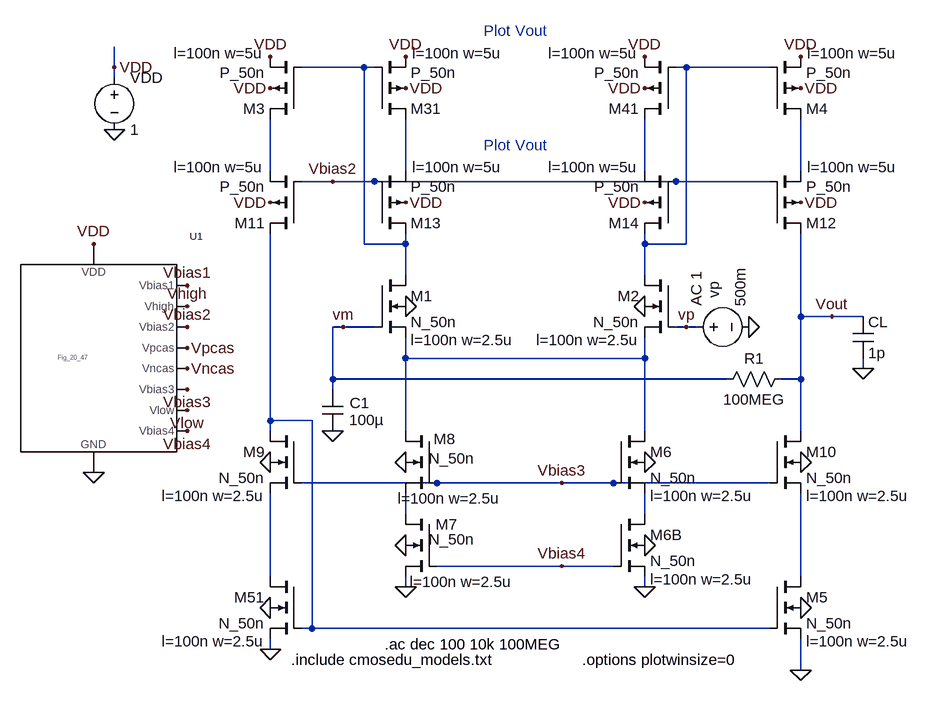
[diagram p0: schematic Fig24_36.asc]
Fig24_36.asc, the LTspice schematic file:
Version 4
SHEET 1 2652 680
WIRE 1136 -960 1136 -992
WIRE 1520 -960 1424 -960
WIRE 1536 -960 1520 -960
WIRE 2016 -960 2000 -960
WIRE 2144 -960 2016 -960
WIRE 1136 -944 1136 -960
WIRE 1376 -800 1376 -880
WIRE 1584 -800 1584 -880
WIRE 1952 -800 1952 -880
WIRE 2192 -800 2192 -880
WIRE 1472 -784 1424 -784
WIRE 1536 -784 1472 -784
WIRE 2000 -784 1536 -784
WIRE 2144 -784 2000 -784
WIRE 1520 -688 1520 -960
WIRE 1584 -688 1584 -704
WIRE 1584 -688 1520 -688
WIRE 1952 -688 1952 -704
WIRE 2016 -688 2016 -960
WIRE 2016 -688 1952 -688
WIRE 1584 -640 1584 -688
WIRE 1952 -640 1952 -688
WIRE 2192 -576 2192 -704
WIRE 2240 -576 2192 -576
WIRE 2288 -576 2240 -576
WIRE 1488 -560 1472 -560
WIRE 1536 -560 1488 -560
WIRE 2016 -560 2000 -560
WIRE 2032 -560 2016 -560
WIRE 1584 -512 1584 -544
WIRE 1952 -512 1952 -544
WIRE 1952 -512 1584 -512
WIRE 2288 -496 2288 -512
WIRE 1472 -480 1472 -560
WIRE 2080 -480 1472 -480
WIRE 2192 -480 2192 -576
WIRE 2192 -480 2160 -480
WIRE 1472 -464 1472 -480
WIRE 1376 -416 1376 -704
WIRE 1440 -416 1376 -416
WIRE 1376 -400 1376 -416
WIRE 1584 -400 1584 -512
WIRE 1952 -400 1952 -512
WIRE 2192 -400 2192 -480
WIRE 1632 -320 1424 -320
WIRE 1824 -320 1632 -320
WIRE 1904 -320 1824 -320
WIRE 2144 -320 1904 -320
WIRE 1584 -272 1584 -304
WIRE 1952 -272 1952 -304
WIRE 1824 -192 1632 -192
WIRE 1904 -192 1824 -192
WIRE 1376 -176 1376 -304
WIRE 2192 -176 2192 -304
WIRE 1584 -160 1584 -176
WIRE 1952 -160 1952 -176
WIRE 1440 -96 1440 -416
WIRE 1440 -96 1424 -96
WIRE 2144 -96 1440 -96
WIRE 1376 -64 1376 -80
WIRE 2192 -32 2192 -80
FLAG 1136 -864 0
FLAG 1136 -960 VDD
FLAG 1952 -592 0
FLAG 1952 -160 0
FLAG 1584 -592 0
FLAG 1376 -928 VDD
FLAG 1104 -688 VDD
FLAG 1104 -336 0
FLAG 1248 -624 Vbias1
FLAG 1248 -592 Vhigh
FLAG 1248 -560 Vbias2
FLAG 1248 -464 Vbias3
FLAG 1248 -528 Vpcas
FLAG 1248 -496 Vncas
FLAG 1248 -400 Vbias4
FLAG 1248 -432 Vlow
FLAG 1376 -976 VDD
FLAG 1952 -224 0
FLAG 2112 -560 0
FLAG 1488 -560 vm
FLAG 2016 -560 vp
FLAG 1376 -64 0
FLAG 2192 -928 VDD
FLAG 2192 -32 0
FLAG 2192 -976 VDD
FLAG 2240 -576 Vout
FLAG 1472 -400 0
FLAG 2288 -496 0
FLAG 1584 -928 VDD
FLAG 1584 -976 VDD
FLAG 1952 -976 VDD
FLAG 1952 -928 VDD
FLAG 1952 -352 0
FLAG 1584 -160 0
FLAG 1584 -224 0
FLAG 1584 -352 0
FLAG 1824 -320 Vbias3
FLAG 1824 -192 Vbias4
FLAG 1376 -352 0
FLAG 1376 -128 0
FLAG 2192 -128 0
FLAG 2192 -352 0
FLAG 1376 -752 VDD
FLAG 2192 -752 VDD
FLAG 1584 -752 VDD
FLAG 1952 -752 VDD
FLAG 1472 -784 Vbias2
SYMBOL voltage 1136 -960 R0
WINDOW 123 0 0 Left 2
WINDOW 39 0 0 Left 2
SYMATTR InstName VDD
SYMATTR Value 1
SYMBOL nmos4 2000 -640 M0
WINDOW 123 56 100 Left 2
SYMATTR Value2 l=100n w=2.5u
SYMATTR InstName M2
SYMATTR Value N_50n
SYMBOL nmos4 1536 -640 R0
WINDOW 123 56 100 Left 2
SYMATTR Value2 l=100n w=2.5u
SYMATTR InstName M1
SYMATTR Value N_50n
SYMBOL pmos4 1424 -880 R180
WINDOW 123 58 102 Left 2
WINDOW 0 56 16 Left 2
SYMATTR Value2 l=100n w=5u
SYMATTR InstName M3
SYMATTR Value P_50n
SYMBOL Fig_20_47 1104 -512 R0
SYMATTR InstName U1
SYMBOL nmos4 1904 -272 R0
WINDOW 123 56 100 Left 2
SYMATTR Value2 l=100n w=2.5u
SYMATTR InstName M6B
SYMATTR Value N_50n
SYMBOL voltage 2016 -560 R270
WINDOW 0 45 42 Left 2
WINDOW 3 31 83 Left 2
WINDOW 39 0 0 Left 2
WINDOW 123 32 15 Left 2
SYMATTR InstName vp
SYMATTR Value 500m
SYMATTR Value2 AC 1
SYMBOL nmos4 1424 -176 M0
WINDOW 123 56 100 Left 2
SYMATTR Value2 l=100n w=2.5u
SYMATTR InstName M51
SYMATTR Value N_50n
SYMBOL pmos4 2144 -880 M180
WINDOW 123 58 102 Left 2
WINDOW 0 56 16 Left 2
SYMATTR Value2 l=100n w=5u
SYMATTR InstName M4
SYMATTR Value P_50n
SYMBOL nmos4 2144 -176 R0
WINDOW 123 56 100 Left 2
SYMATTR Value2 l=100n w=2.5u
SYMATTR InstName M5
SYMATTR Value N_50n
SYMBOL res 2064 -464 R270
WINDOW 0 32 56 VTop 2
WINDOW 3 0 56 VBottom 2
SYMATTR InstName R1
SYMATTR Value 100MEG
SYMBOL cap 2272 -576 R0
SYMATTR InstName CL
SYMATTR Value 1p
SYMBOL pmos4 1536 -880 M180
WINDOW 123 58 102 Left 2
WINDOW 0 56 16 Left 2
SYMATTR Value2 l=100n w=5u
SYMATTR InstName M31
SYMATTR Value P_50n
SYMBOL pmos4 2000 -880 R180
WINDOW 123 58 102 Left 2
WINDOW 0 56 16 Left 2
SYMATTR Value2 l=100n w=5u
SYMATTR InstName M41
SYMATTR Value P_50n
SYMBOL cap 1456 -464 R0
WINDOW 0 42 21 Left 2
WINDOW 3 41 47 Left 2
SYMATTR InstName C1
SYMATTR Value 100µ
SYMBOL nmos4 1904 -400 R0
WINDOW 123 56 100 Left 2
SYMATTR Value2 l=100n w=2.5u
SYMATTR InstName M6
SYMATTR Value N_50n
SYMBOL nmos4 1632 -272 M0
WINDOW 123 -117 104 Left 2
WINDOW 0 -32 16 Left 2
WINDOW 3 -59 39 Left 2
SYMATTR Value2 l=100n w=2.5u
SYMATTR InstName M7
SYMATTR Value N_50n
SYMBOL nmos4 1632 -400 M0
WINDOW 123 -99 104 Left 2
WINDOW 0 -29 12 Left 2
WINDOW 3 -59 42 Left 2
SYMATTR Value2 l=100n w=2.5u
SYMATTR InstName M8
SYMATTR Value N_50n
SYMBOL nmos4 1424 -400 M0
WINDOW 123 56 100 Left 2
SYMATTR Value2 l=100n w=2.5u
SYMATTR InstName M9
SYMATTR Value N_50n
SYMBOL nmos4 2144 -400 R0
WINDOW 123 56 100 Left 2
SYMATTR Value2 l=100n w=2.5u
SYMATTR InstName M10
SYMATTR Value N_50n
SYMBOL pmos4 1424 -704 R180
WINDOW 123 58 102 Left 2
WINDOW 0 56 16 Left 2
SYMATTR Value2 l=100n w=5u
SYMATTR InstName M11
SYMATTR Value P_50n
SYMBOL pmos4 2144 -704 M180
WINDOW 123 58 102 Left 2
WINDOW 0 56 16 Left 2
SYMATTR Value2 l=100n w=5u
SYMATTR InstName M12
SYMATTR Value P_50n
SYMBOL pmos4 1536 -704 M180
WINDOW 123 58 102 Left 2
WINDOW 0 56 16 Left 2
SYMATTR Value2 l=100n w=5u
SYMATTR InstName M13
SYMATTR Value P_50n
SYMBOL pmos4 2000 -704 R180
WINDOW 123 58 102 Left 2
WINDOW 0 56 16 Left 2
SYMATTR Value2 l=100n w=5u
SYMATTR InstName M14
SYMATTR Value P_50n
TEXT 1408 -48 Left 2 !.include cmosedu_models.txt
TEXT 1704 -1016 Left 2 ;Plot Vout
TEXT 1552 -72 Left 2 !.ac dec 100 10k 100MEG
TEXT 1704 -840 Left 2 ;Plot Vout
TEXT 1856 -48 Left 2 !.options plotwinsize=0

The netlist it stands for:
* Fig24_36.asc
VDD VDD 0 1
M2 N002 vp N007 0 N_50n l=100n w=2.5u
M1 N001 vm N007 0 N_50n l=100n w=2.5u
M3 N003 N001 VDD VDD P_50n l=100n w=5u
XU1 Vbias1 Vhigh Vbias2 Vpcas Vncas Vbias3 Vlow Vbias4 VDD 0 Fig_20_47  ; pins Vbias1 Vhigh Vbias2 Vpcas Vncas Vbias3 Vlow Vbias4 VDD GND
M6B N010 Vbias4 0 0 N_50n l=100n w=2.5u
vp vp 0 500m AC 1
M51 N011 N008 0 0 N_50n l=100n w=2.5u
M4 N006 N002 VDD VDD P_50n l=100n w=5u
M5 N012 N008 0 0 N_50n l=100n w=2.5u
R1 vm Vout 100MEG
CL Vout 0 1p
M31 N004 N001 VDD VDD P_50n l=100n w=5u
M41 N005 N002 VDD VDD P_50n l=100n w=5u
C1 vm 0 100µ
M6 N007 Vbias3 N010 0 N_50n l=100n w=2.5u
M7 N009 Vbias4 0 0 N_50n l=100n w=2.5u
M8 N007 Vbias3 N009 0 N_50n l=100n w=2.5u
M9 N008 Vbias3 N011 0 N_50n l=100n w=2.5u
M10 Vout Vbias3 N012 0 N_50n l=100n w=2.5u
M11 N008 Vbias2 N003 VDD P_50n l=100n w=5u
M12 Vout Vbias2 N006 VDD P_50n l=100n w=5u
M13 N001 Vbias2 N004 VDD P_50n l=100n w=5u
M14 N002 Vbias2 N005 VDD P_50n l=100n w=5u
.model NMOS NMOS
.model PMOS PMOS
.lib standard.mos
.include cmosedu_models.txt
* Plot Vout
.ac dec 100 10k 100MEG
* Plot Vout
.options plotwinsize=0
.backanno
.end